# EasyEDA Pro project Attiny85 Tach board.eprj

# Schematic With Schmitt New opto type
Board Name: Board2_2; Create Date: 2026-06-11; Page Name: P1; Project Name: Attiny85 Tach board; Schematic Name: With Schmitt New opto type; Update Date: 2026-06-12; Company: EasyEDA.com; Page Size: A4; Version: V1.0
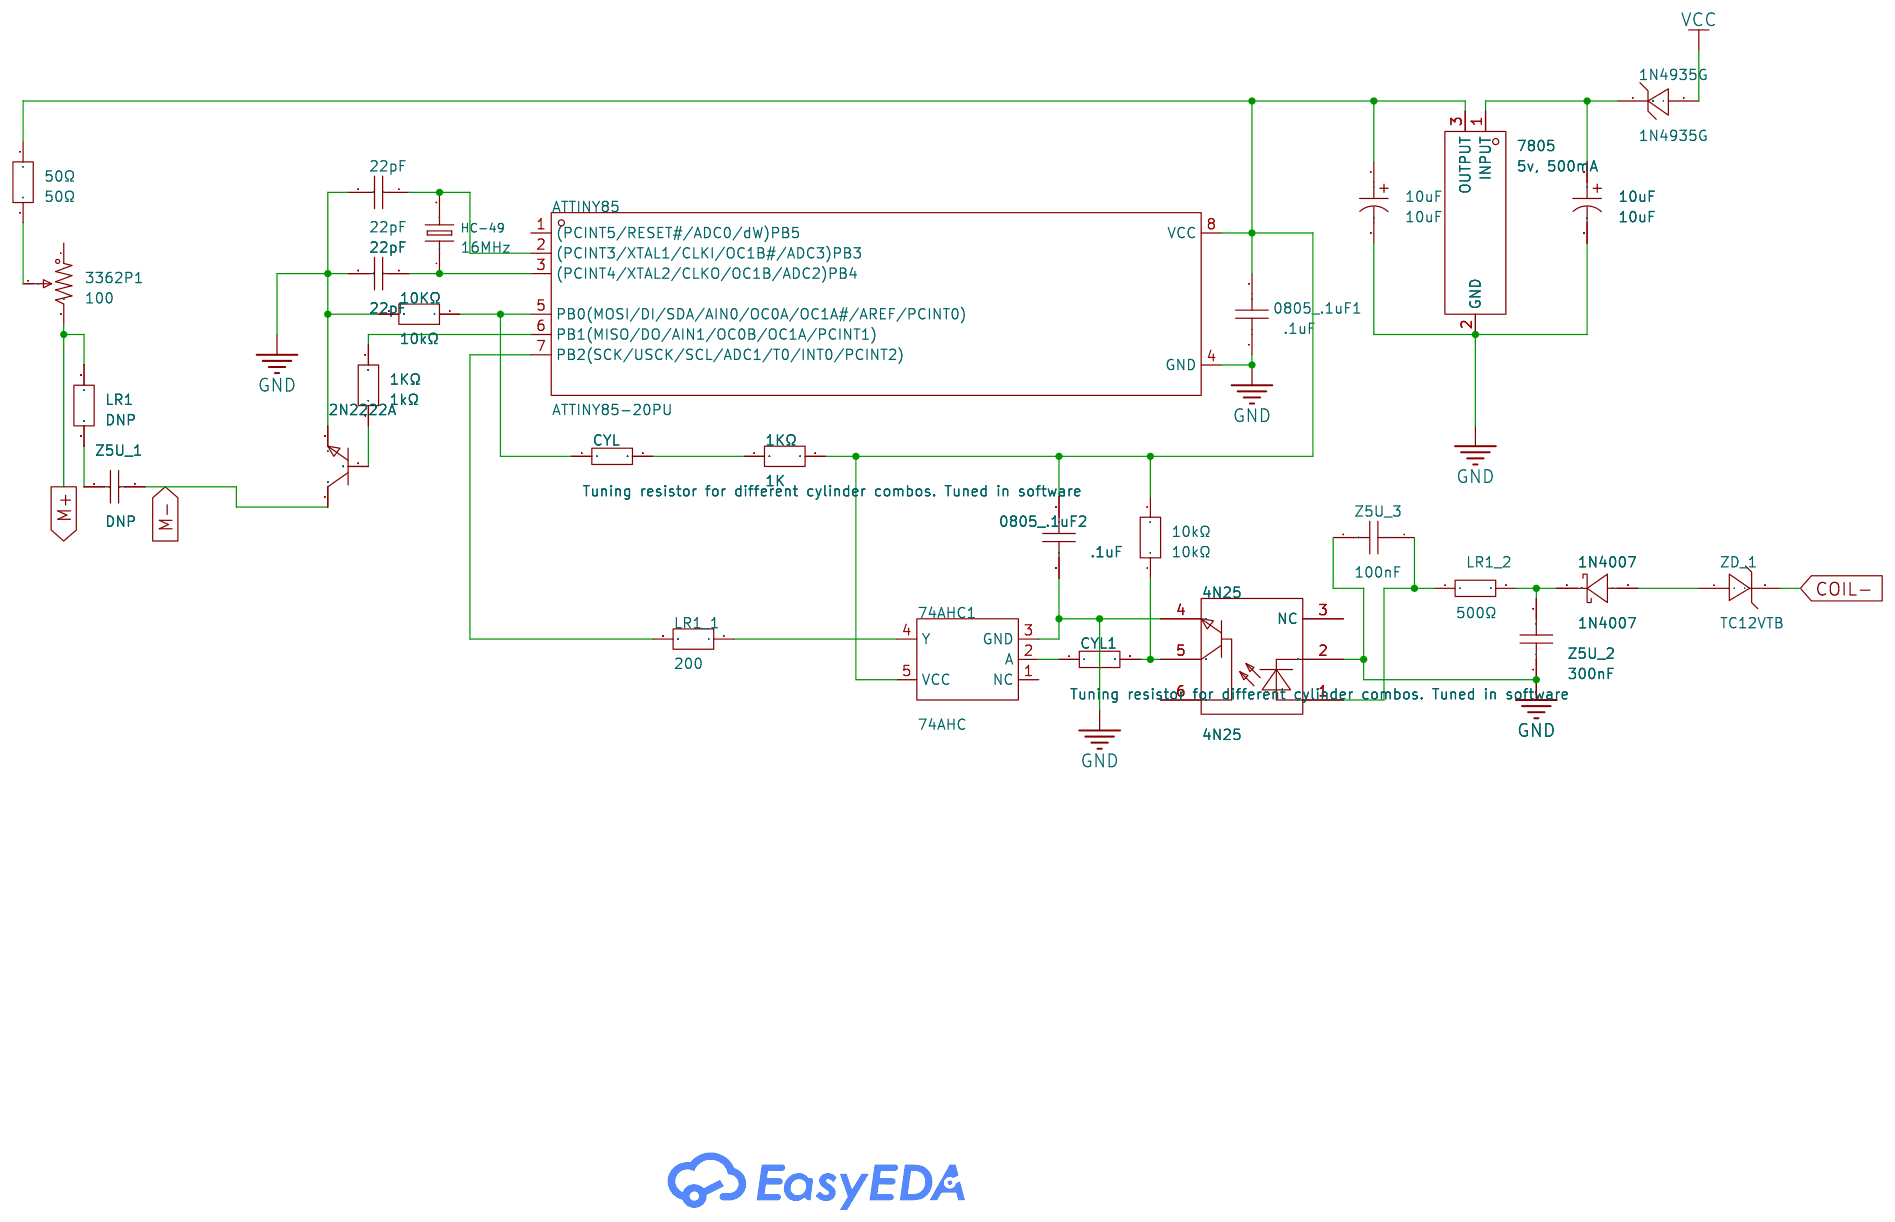
[diagram p0: schematic sheet]

## Parts
1KΩ  1kΩ  [RES-TH_BD2.5-L6.5-P10.50-D0.6]
1KΩ#2  1K  [RES-TH_BD2.5-L6.5-P10.50-D0.6]
1N4007  1N4007  [DO-41_BD2.4-L4.7-P8.70-D0.8-RD]
1N4935G  1N4935G  [DO-41_BD2.4-L4.7-P8.70-D0.9-RD]
2N2222A  3 Pin transistor  [TO-92-3_L4.8-W3.7-P2.54-R]
4N25  4N25  [DIP-6_L7.1-W6.5-P2.54-LS7.6-BL]
10KΩ  10kΩ  [RES-TH_BD2.5-L6.5-P10.50-D0.6]
10kΩ  10kΩ  [RES-TH_BD2.5-L6.5-P10.50-D0.6]
10uF  10uF  [CAP-TH_BD5.0-P2.00-D0.5-FD]
10uF#2  10uF  [CAP-TH_BD5.0-P2.00-D0.5-FD]
22pF  22pF  [CAP-TH_L5.0-W3.2-P2.50-D0.5]
22pF#2  22pF  [CAP-TH_L5.0-W3.2-P2.50-D0.5]
50Ω  50Ω  [RES-TH_BD2.5-L6.5-P10.50-D0.6]
74AHC1  74AHC  [SOT-23-5_L3.0-W1.5-P0.95-LS2.8-BL]
0805_.1uF1  .1uF  [C0805]
0805_.1uF2  .1uF  [C0805]
3362P1  100  [RES-ADJ-TH_3362P]
7805  5v, 500mA  [TO-220-3_L10.0-W4.5-P2.54-L]
ATTINY85  ATTINY85-20PU  [PDIP-8_L9.3-W6.4-P2.54-LS7.9-BL-1]
CYL  Tuning resistor for different cylinder combos. Tuned in software  [C0805]
CYL1  Tuning resistor for different cylinder combos. Tuned in software  [C0805]
HC-49  16MHz  [HC-49US_L11.5-W4.5-P4.88]
LR1  DNP  [RES-TH_BD2.5-L6.5-P10.50-D0.6]
LR1_1  200  [RES-TH_BD2.5-L6.5-P10.50-D0.6]
LR1_2  500Ω  [RES-TH_BD2.5-L6.5-P10.50-D0.6]
Z5U_1  DNP  [CAP-TH_L5.0-W3.2-P2.50-D0.5]
Z5U_2  300nF  [CAP-TH_L4.5-W3.0-P5.00-D0.5]
Z5U_3  100nF  [CAP-TH_L4.5-W3.0-P5.00-D0.5]
ZD_1  TC12VTB  [DO-35_BD2.0-L4.2-P8.20-D0.5-R-RD]

## Library data of the parts
1KΩ 1KΩ#2 10KΩ 50Ω LR1 LR1_1 = NFR25H0001001JR500: Type:Metal Film Resistor Resistance:1kΩ Tolerance:±5% Tolerance:±5% Power(Watts):500mW Temperature Coefficient:±100ppm/℃ Temperature Coefficient:±100ppm/℃ Operating Temperature:-55℃~+155℃ Operating Temperature:-55℃~+155℃; LCSC Part Name: 金属膜电阻 1kΩ ±5% 500mW; Supplier Part: C1741005; Manufacturer: VISHAY(威世); Supplier Footprint: 插件,D2.5xL6.5mm; JLCPCB Part Class: Extended Part; Datasheet: https://item.szlcsc.com/datasheet/NFR25H0001001JR500/1831786.html; Supplier: LCSC; Type: Metal Film Resistor; Tolerance: ±5%; Power(Watts): 500mW; Temperature Coefficient: ±100ppm/℃; Operating Temperature: -55℃~+155℃
1N4007 = 1N4007_C53664484: Diode Configuration:1 Independent Voltage - Forward(Vf@If):1.1V@1A Voltage - DC Reverse(Vr):1kV Current - Rectified:1A Reverse Leakage Current (Ir):5uA@1000V Non-Repetitive Peak Forward Surge Current:30A Operating Junction Temperature Range:-55℃~+150℃ Ope; LCSC Part Name: 轴向通用整流二极管，低正向压降、高电流能力、高可靠性和高浪涌电流能力; Supplier Part: C53664484; Manufacturer: R+O(宏嘉诚); Supplier Footprint: DO-41; JLCPCB Part Class: Extended Part; Datasheet: https://item.szlcsc.com/datasheet/1N4007/56855908.html; Supplier: LCSC; Diode Configuration: 1 Independent; Voltage - Forward(Vf@If): 1.1V@1A; Voltage - DC Reverse(Vr): 1kV; Current - Rectified: 1A; Reverse Leakage Current (Ir): 5uA@1000V; Non-Repetitive Peak Forward Surge Current: 30A; Operating Junction Temperature Range: -55℃~+150℃
1N4935G = 1N4935G: LCSC Part Name: 耐压:200V 电流:1A 反向恢复时间：150ns; Supplier Part: C898876; Manufacturer: onsemi(安森美); Supplier Footprint: DO-41; JLCPCB Part Class: Extended Part; Datasheet: https://item.szlcsc.com/datasheet/1N4935G/964313.html; Supplier: LCSC; Voltage - Forward(Vf@If): 1.05V@1A; Voltage - DC Reverse(Vr): 200V; Current - Rectified: 1A; Reverse Leakage Current (Ir): 1uA@200V; Reverse Recovery Time (trr): 150ns; Operating Junction Temperature Range: -65℃~+150℃; Non-Repetitive Peak Forward Surge Current: 30A
2N2222A = 2N2222A_C358533: LCSC Part Name: (100-300) TO-92塑封封装NPN半导体三极管 NPN 电流:600mA 电压:40V; Supplier Part: C358533; Manufacturer: BLUE ROCKET(蓝箭); Supplier Footprint: TO-92; JLCPCB Part Class: Extended Part; Datasheet: https://item.szlcsc.com/datasheet/2N2222A/333502.html; Supplier: LCSC; type: NPN; Current - Collector(Ic): 600mA; Collector - Emitter Voltage VCEO: 40V; Pd - Power Dissipation: 625mW; DC Current Gain: 100@150mA,10V; Transition frequency(fT): 300MHz; Current - Collector Cutoff: 10nA; Vce Saturation(VCE(sat)): 300mV@150mA,15mA; Emitter-Base Voltage(Vebo): 6V; Number: 1 NPN
4N25 = 4N25: Forward Voltage:1.3V Output Current:50mA Isolation Voltage(rms):5kV Number of Outputs:1 Rise time:2us Fall time:2us Operating Temperature:-55℃~+100℃ Operating Temperature:-55℃~+100℃; Supplier Part: C3008818; Manufacturer: VISHAY(威世); Supplier Footprint: DIP-6; JLCPCB Part Class: Extended Part; Datasheet: https://atta.szlcsc.com/upload/public/pdf/source/20220512/DCD730118474C0EE1EA694047C839E34.pdf; Supplier: LCSC; Forward Voltage: 1.3V; Output Current: 50mA; Isolation Voltage(rms): 5kV; Number of Outputs: 1; Rise time: 2us; Fall time: 2us; Operating Temperature: -55℃~+100℃
10kΩ = LR1F1K0: Type:Metal Film Resistor Resistance:1kΩ Tolerance:±1% Tolerance:±1% Power(Watts):600mW Temperature Coefficient:±50ppm/℃ Temperature Coefficient:±50ppm/℃ Operating Temperature:- Operating Temperature:-; LCSC Part Name: 金属膜电阻 1kΩ ±1% 600mW; Supplier Part: C1364136; Manufacturer: TE Connectivity(泰科电子); Supplier Footprint: 插件; JLCPCB Part Class: Extended Part; Datasheet: https://item.szlcsc.com/datasheet/LR1F1K0/1454424.html; Supplier: LCSC; Type: Metal Film Resistor; Tolerance: ±1%; Power(Watts): 600mW; Temperature Coefficient: ±50ppm/℃
10uF 10uF#2 = ECA-1EM100: Capacitance: Tolerance:±20% Tolerance:±20% Rated Voltage: Ripple Current:85mA@10kHz Equivalent Series Resistance(ESR):- Lead Spacing: φD: Lifetime @ Temp:2000hrs@85℃ Operating Temperature:-40℃~+85℃ Operating Temperature:-40℃~+85℃; LCSC Part Name: 10uF ±20% 25V; Supplier Part: C1580384; Manufacturer: PANASONIC(松下); Supplier Footprint: 插件; JLCPCB Part Class: Extended Part; Datasheet: https://atta.szlcsc.com/upload/public/pdf/source/20210615/C1580384_709C93ACF7E1C72DB0708202B2806885.pdf; Supplier: LCSC; Tolerance: ±20%; Ripple Current: 85mA@10kHz; Lifetime @ Temp: 2000hrs@85℃; Operating Temperature: -40℃~+85℃
22pF 22pF#2 Z5U_1 = K220K15C0GH53L2: Capacitance:22pF Tolerance:±10% Tolerance:±10% Voltage Rating:100V Temperature Coefficient:C0G Pin Spacing:2.5mm; LCSC Part Name: 22pF ±10% 100V; Supplier Part: C1621360; Manufacturer: VISHAY(威世); Supplier Footprint: 插件,P=2.5mm; JLCPCB Part Class: Extended Part; Datasheet: https://item.szlcsc.com/datasheet/K220K15C0GH53L2/1712206.html; Supplier: LCSC; Tolerance: ±10%; Voltage Rating: 100V; Temperature Coefficient: C0G; Pin Spacing: 2.5mm
74AHC1 = 74AHC1G14GV: LCSC Part Name: 单施密特触发器反相器门; Supplier Part: C19829586; Manufacturer: TECH PUBLIC(台舟); Supplier Footprint: SOT-23-5; JLCPCB Part Class: Extended Part; Datasheet: https://item.szlcsc.com/datasheet/74AHC1G14GV/21156881.html; Supplier: LCSC; Number of Channels: 1; Voltage - Supply: 2V~5.5V; Quiescent Current: 40uA; Current - Output Low(IOL): 8mA; Current - Output High(IOH): 8mA; Input Logic Level - High: 2.15V~3.85V；1.75V~3.15V；1.2V~2.2V; Input Logic Level - Low: 900mV~1.9V；1.35V~2.75V；1.65V~3.35V; Propagation Delay: 16.3ns@3.3V,15pF; Operating Temperature: -40℃~+125℃; Input Number: 1
0805_.1uF1 0805_.1uF2 = CGA0805X6S107M4R0MT: Capacitance:100uF Tolerance:±20% Tolerance:±20% Voltage Rating:4V Temperature Coefficient:X6S; LCSC Part Name: 100uF ±20% 4V; Supplier Part: C42371696; Manufacturer: HRE(芯声); Supplier Footprint: 0805; Datasheet: https://item.szlcsc.com/datasheet/CGA0805X6S107M4R0MT/44253246.html; Supplier: LCSC; Tolerance: ±20%; Voltage Rating: 4V; Temperature Coefficient: X6S
3362P1 = 3362P-1-103_C118956: LCSC Part Name: 10kΩ ±10%; Supplier Part: C118956; Manufacturer: BOCHEN(博晨); Manufacturer Part: 3362P-1-103; Supplier Footprint: 插件; JLCPCB Part Class: Extended Part; Datasheet: https://atta.szlcsc.com/upload/public/pdf/source/20171114/C118956_15106326650691117445.pdf; Supplier: LCSC; Tolerance: ±10%
7805 = L7805CV(UMW): LCSC Part Name: 输入35V 输出5V 1.2A; Supplier Part: C347289; Manufacturer: UMW(友台半导体); Supplier Footprint: TO-220; JLCPCB Part Class: Extended Part; Datasheet: https://item.szlcsc.com/datasheet/L7805CV(UMW)/323949.html; Supplier: LCSC; Output Type: Fixed; Voltage - Supply: 20V; Output Voltage: 5V; Output Current: 1.2A; standby current: 6mA; Features: Short Circuit Protection；Over Temperature Protection; Operating Temperature: -40℃~+105℃@(Ta); Output Configuration: Positive; Number of Outputs: 1
ATTINY85 = ATTINY85-20PU: Supplier Part: C965497; Manufacturer: MICROCHIP(美国微芯); Supplier Footprint: PDIP-8; JLCPCB Part Class: Extended Part; Datasheet: https://item.szlcsc.com/datasheet/ATTINY85-20PU/1052792.html; Supplier: LCSC; CPU Core: AVR; CPU Maximum Speed: 20MHz; Core Size: 8 Bit; Program Storage Size: 8KB; Program Memory Type: FLASH; RAM Size: 512Byte; EEPROM: 512Byte; Number of I/O: 6; ADC (Bit): 10bit; Oscillator Type: Built-in; Voltage - Supply: 2.7V~5.5V; Operating Temperature: -40℃~+85℃
CYL CYL1 = Res_0603: Supplier Footprint: 0603
HC-49 = HC-49/U-S20000000ABJB: LCSC Part Name: 20MHz ±30ppm 18pF; Supplier Part: C326539; Manufacturer: CITIZEN; Supplier Footprint: HC-49S; JLCPCB Part Class: Extended Part; Datasheet: https://atta.szlcsc.com/upload/public/pdf/source/20181213/C326539_623418ED4432342CEDE2EF69401BC513.pdf; Supplier: LCSC; Normal temperature Frequency Tolerance: ±30ppm; Frequency Stability(Full temperature range): ±50ppm; Equivalent Series Resistance (ESR): 50Ω
LR1_2 = RN1WS390ΩFT/BA1: Type:Metal Film Resistor Resistance:390Ω Tolerance:±1% Tolerance:±1% Voltage-Supply(Max):350V Power(Watts):1W Temperature Coefficient:±50ppm/℃ Temperature Coefficient:±50ppm/℃; LCSC Part Name: 390Ω ±1% 1W 金属膜电阻; Supplier Part: C385382; Manufacturer: Tyohm(幸亚电阻); Manufacturer Part: NFR25H0001001JR500; Supplier Footprint: 插件,D3.3xL9.2mm; JLCPCB Part Class: Extended Part; Datasheet: https://item.szlcsc.com/datasheet/RN1WS390%25CE%25A9FT%252FBA1/359229.html; Supplier: LCSC; Type: Metal Film Resistor; Tolerance: ±1%; Voltage-Supply(Max): 350V; Power(Watts): 1W; Temperature Coefficient: ±50ppm/℃
Z5U_2 = FG24X7R1H224KNT00: Capacitance: Tolerance:±10% Tolerance:±10% Voltage Rated: Temperature Coefficient:; LCSC Part Name: 220nF ±10% 50V; Supplier Part: C3690393; Manufacturer: TDK; JLCPCB Part Class: Extended Part; Supplier: LCSC; Tolerance: ±10%
Z5U_3 = FG24X7R2A104KNT00: Capacitance:0.1uF Tolerance:±10% Tolerance:±10% Voltage Rated: Temperature Coefficient:; LCSC Part Name: 100nF ±10% 100V; Supplier Part: C1623763; Manufacturer: TDK; Supplier Footprint: 插件; JLCPCB Part Class: Extended Part; Datasheet: https://atta.szlcsc.com/upload/public/pdf/source/20210603/7C07ADBE9CEF1AEE8735D13453ED6990.pdf; Supplier: LCSC; Tolerance: ±10%
ZD_1 = TC12VTB: Diode Configuration:1 Independent Zener Voltage(Nom):12V Reverse Leakage Current (Ir):200nA@9V Zener Voltage(Range):11.4V~12.6V Zener Voltage(Range):11.4V~12.6V Pd - Power Dissipation:500mW Impedance(Zzt):30Ω Impedance(Zzk):- Operating Junction Temperatur; LCSC Part Name: 独立式 耐压:12V 电流:200nA@9V; Supplier Part: C261230; Manufacturer: TC(德昌); Supplier Footprint: DO-35; JLCPCB Part Class: Extended Part; Datasheet: https://item.szlcsc.com/datasheet/TC12VTB/252943.html; Supplier: LCSC; Diode Configuration: 1 Independent; Zener Voltage(Nom): 12V; Reverse Leakage Current (Ir): 200nA@9V; Zener Voltage(Range): 11.4V~12.6V; Pd - Power Dissipation: 500mW; Impedance(Zzt): 30Ω; Tolerance: ±5%

## Nets
GND: 2N2222A.3(E) 4N25.2 4N25.4 10KΩ.2 10uF.2 10uF#2.2 22pF.2 22pF#2.2 74AHC1.3(GND) 0805_.1uF1.1 0805_.1uF2.1 7805.2(GND) ATTINY85.4(GND) Z5U_2.1 Z5U_3.2
VCC: 1N4935G.2(A)
COIL-: ZD_1.2(K)
M+: 3362P1.3 LR1.1
M-: 2N2222A.1(C) Z5U_1.1
$1N8148: 4N25.1 LR1_2.1 Z5U_3.1
$1N8161: 1N4007.1(C) LR1_2.2 Z5U_2.2
$1N8165: 1N4007.2(A) ZD_1.1(A)
$1N10209: 10KΩ.1 ATTINY85.5(PB0(MOSI/DI/SDA/AIN0/OC0A/OC1A#/AREF/PCINT0)) CYL.1
$1N10211: 50Ω.2 3362P1.2
$1N10216: ATTINY85.7(PB2(SCK/USCK/SCL/ADC1/T0/INT0/PCINT2)) LR1_1.2
$1N10218: LR1.2 Z5U_1.2
$1N10220: 74AHC1.4(Y) LR1_1.1
$1N10223: 1N4935G.1(C) 10uF.1 7805.1(INPUT)
$1N10386: 74AHC1.2(A) CYL1.1
$1N10391: 4N25.5 10kΩ.1 CYL1.2
Net-(1KΩ#2-1): 1KΩ#2.1 10kΩ.2 10uF#2.1 50Ω.1 74AHC1.5(VCC) 0805_.1uF1.2 0805_.1uF2.2 7805.3(OUTPUT) ATTINY85.8(VCC)
Net-(1KΩ#2-2): 1KΩ#2.2 CYL.2
Net-(1KΩ-1): 1KΩ.1 2N2222A.2(B)
Net-(1KΩ-2): 1KΩ.2 ATTINY85.6(PB1(MISO/DO/AIN1/OC0B/OC1A/PCINT1))
Net-(22pF#2-1): 22pF#2.1 ATTINY85.2((PCINT3/XTAL1/CLKI/OC1B#/ADC3)PB3) HC-49.2
Net-(22pF-1): 22pF.1 ATTINY85.3((PCINT4/XTAL2/CLKO/OC1B/ADC2)PB4) HC-49.1

Not connected (* = marked no-connect by the designer): 4N25 3(NC) 6; 74AHC1 1(NC); 3362P1 1; ATTINY85 1((PCINT5/RESET#/ADC0/dW)PB5)

# Board Board Type A
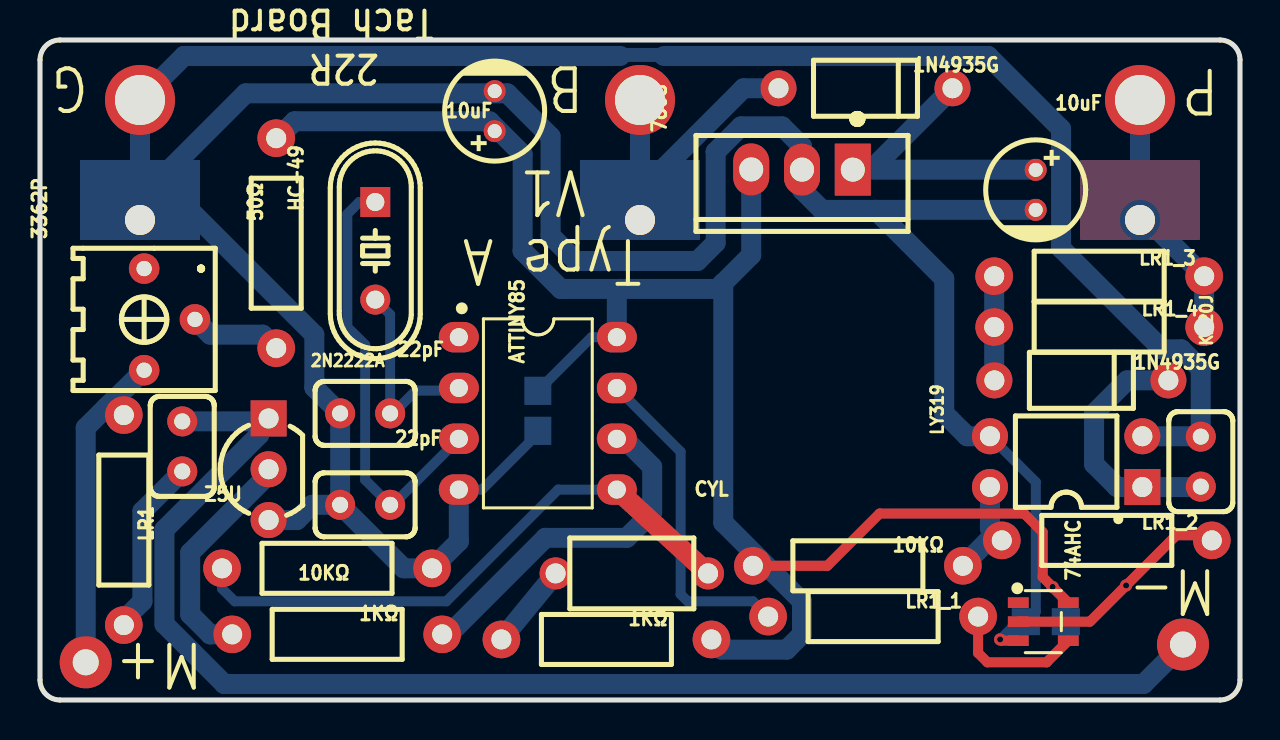
[diagram p1: board, top side]
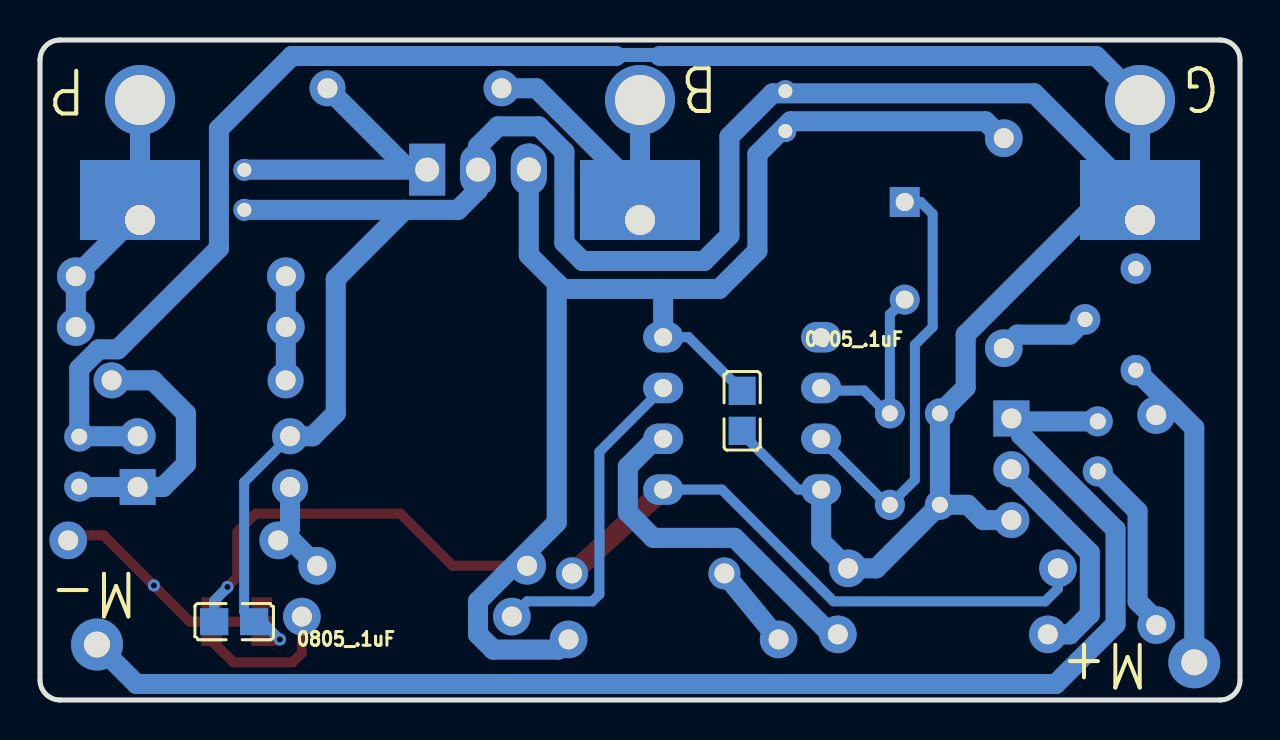
[diagram p2: board, bottom side, seen from below]

Outline 60 x 33 mm; copper layers: Top Layer, Bottom Layer. Coordinates in mm from the lower left corner of the outline.
Outline path: 0,32 0,1 arc(0.29,0.29) 1,0 59,0 arc(59.71,0.29) 60,1 60,32 arc(59.71,32.71) 59,33 1,33 arc(0.29,32.71) 0,32
Stack: Top Layer 0.035mm / Dielectric1 1.51mm FR4 er 4.5 / Bottom Layer 0.035mm

## Design rules (mm)
template: JLCPCB Capability(Two Layers Board)
spacing copperThickness1oz (default): track to track 0.102, other pairs 0.152 to 0.3
spacing copperThickness2oz: track to track 0.203, other pairs 0.152 to 0.3
track width copperThickness1oz (default): min 0.127, default 0.254, max 2.54
track width copperThickness2oz: min 0.203, default 0.254, max 2.54
differential pair differentialPair (default): width min 0.127, default 0.254, max 2.54; gap min 0.152, default 0.152
via viaSize (default): diameter min 0.5, default 0.61, max 10; hole min 0.3, default 0.305, max 6.3

## Placement (name value [footprint] x y rotation side)
1KΩ  -  [RES-TH_BD2.5-L6.5-P10.50-D0.6]  28.32 3.03 180 top
1KΩ#2  -  [RES-TH_BD2.5-L6.5-P10.50-D0.6]  14.86 3.28 0 top
1N4935G  -  [DO-41_BD2.4-L4.7-P8.70-D0.9-RD]  41.28 30.59 180 top
1N4935G#2  -  [DO-41_BD2.4-L4.7-P8.70-D0.9-RD]  52.07 15.98 180 top
2N2222A  3 Pin transistor  [TO-92-3_L4.8-W3.7-P2.54-R]  11.43 11.54 90 top
10KΩ  -  [RES-TH_BD2.5-L6.5-P10.50-D0.6]  40.89 6.71 0 top
10KΩ#2  -  [RES-TH_BD2.5-L6.5-P10.50-D0.6]  14.35 6.58 0 top
10uF  -  [CAP-TH_BD5.0-P2.00-D0.5-FD]  22.73 29.44 90 top
10uF#2  -  [CAP-TH_BD5.0-P2.00-D0.5-FD]  49.78 25.51 270 top
22pF  -  [CAP-TH_L5.0-W3.2-P2.50-D0.5]  16.26 9.76 180 top
22pF#2  -  [CAP-TH_L5.0-W3.2-P2.50-D0.5]  16.26 14.33 180 top
50Ω  50Ω  [RES-TH_BD2.5-L6.5-P10.50-D0.6]  11.81 22.84 270 top
74AHC  74AHC  [SOT-23-5_L3.0-W1.5-P0.95-LS2.8-BL]  50.16 3.92 270 top
0805_.1uF  -  [C0805]  24.89 14.46 90 bottom
0805_.1uF#2  -  [C0805]  50.29 3.92 0 bottom
3362P  100  [RES-ADJ-TH_3362P]  6.48 19.03 270 top
7805  5v, 500mA  [TO-220-3_L10.0-W4.5-P2.54-L]  38.1 26.52 180 top
ATTINY85  ATTINY85-20PU  [PDIP-8_L9.3-W6.4-P2.54-LS7.9-BL-1]  24.89 14.33 270 top
CYL  DS04-254-2L-01BK  [SW-TH_DS04-254-2L-01BK]  29.59 6.33 90 top
HC-49  16MHz  [HC-49US_L11.5-W4.5-P4.88]  16.76 22.46 270 top
K220J  DNP  [CAP-TH_L5.0-W3.2-P2.50-D0.5]  58.04 11.92 270 top
LR1  DNP  [RES-TH_BD2.5-L6.5-P10.50-D0.6]  4.19 9 270 top
LR1_1  200  [RES-TH_BD2.5-L6.5-P10.50-D0.6]  41.66 4.17 180 top
LR1_2  10Ω  [RES-TH_BD2.5-L6.5-P10.50-D0.6]  53.34 7.98 180 top
LR1_3  22KΩ  [RES-TH_BD2.5-L6.5-P10.50-D0.6]  52.96 21.19 0 top
LR1_4  33KΩ  [RES-TH_BD2.5-L6.5-P10.50-D0.6]  52.96 18.65 180 top
LY319  Optocoupler  [DIP-4_L6.5-W4.6-P2.54-LS7.6-BL]  51.31 11.92 90 top
NOREF  -  [Pad_e362]  30 24 0 top
NOREF#2  -  [Pad_e34]  57.15 2.77 90 top
NOREF#3  -  [Pad_e360]  55 25 0 top
NOREF#4  -  [Pad_e359]  5 25 0 top
NOREF#5  -  [Pad_e357]  30 25 0 top
NOREF#6  -  [Pad_e368]  55 24 0 top
NOREF#7  -  [Pad_e33]  2.29 1.89 0 top
NOREF#8  -  [Pad_e367]  5 24 0 top
NOREF#9  -  [Pad_e21]  30 30 0 top
NOREF#10  -  [Pad_e22]  55 30 0 top
NOREF#11  -  [Pad_e20]  5 30 0 top
Z5U  DNP  [CAP-TH_L5.0-W3.2-P2.50-D0.5]  7.11 12.68 270 top

## Footprints (pads in the part's own frame, mm; a bottom-side part is the same pattern mirrored in y, then rotated)
C0805
  rect 1.41x1.35 smd: 1(-1,0) 2(1,0)
CAP-TH_BD5.0-P2.00-D0.5-FD
  round 1.1 hole 0.7: 1(-1,0) 2(1,0)
CAP-TH_L5.0-W3.2-P2.50-D0.5
  round 1.5 hole 0.8: 1(-1.25,0) 2(1.25,0)
DIP-4_L6.5-W4.6-P2.54-LS7.6-BL
  rect 1.8x1.8 hole 1: 1(-1.27,-3.81)
  round 1.8 hole 1: 2(1.27,-3.81) 3(1.27,3.81) 4(-1.27,3.81)
DO-41_BD2.4-L4.7-P8.70-D0.9-RD
  round 1.8 hole 1: 1(-4.35,0) 2(4.35,0)
HC-49US_L11.5-W4.5-P4.88
  rect 1.5x1.5 hole 0.9: 1(-2.44,0)
  round 1.5 hole 0.9: 2(2.44,0)
Pad_e20
  round 3.5 hole 2.5: G(0,0)
Pad_e21
  round 3.5 hole 2.5: B(0,0)
Pad_e22
  round 3.5 hole 2.5: P(0,0)
Pad_e33
  round 2.6 hole 1.3: (0,0)
Pad_e34
  round 2.6 hole 1.3: (0,0)
Pad_e357
  rect 6x4 smd far side: 1(0,0)
Pad_e359
  rect 6x4 smd far side: 1(0,0)
Pad_e360
  rect 6x4 smd far side: 1(0,0)
Pad_e362
  round 1.5 hole 1.5: 1(0,0)
Pad_e367
  round 1.5 hole 1.5: 1(0,0)
Pad_e368
  round 1.5 hole 1.5: 1(0,0)
PDIP-8_L9.3-W6.4-P2.54-LS7.9-BL-1
  oval 1.524x2 hole 0.9: 1(-3.81,-3.95) 2(-1.27,-3.95) 3(1.27,-3.95) 4(3.81,-3.95) 5(3.81,3.95) 6(1.27,3.95) 7(-1.27,3.95) 8(-3.81,3.95)
RES-ADJ-TH_3362P
  round 1.524 hole 0.762: 1(-2.54,-1.27) 2(0,1.27) 3(2.54,-1.27)
RES-TH_BD2.5-L6.5-P10.50-D0.6
  round 1.879 hole 1: 1(-5.25,0) 2(5.25,0)
SOT-23-5_L3.0-W1.5-P0.95-LS2.8-BL
  rect 0.532x1.045 smd: 1(-0.95,-1.25) 2(0,-1.25) 3(0.95,-1.25) 4(0.95,1.25) 5(-0.95,1.25)
SW-TH_DS04-254-2L-01BK
  round 1.6 hole 1: 1(0,-3.81) 2(0,3.81)
TO-92-3_L4.8-W3.7-P2.54-R
  rect 1.8x1.8 hole 1: 1(2.54,0)
  round 1.8 hole 1: 2(0,0) 3(-2.54,0)
TO-220-3_L10.0-W4.5-P2.54-L
  rect 1.8x2.6 hole 1.2: 1(-2.54,0.005)
  oval 1.8x2.6 hole 1.2: 2(0,0.005) 3(2.54,-0.005)

## Nets
GND: 2N2222A.3 10KΩ#2.2 10uF.2 10uF#2.2 22pF.2 22pF#2.2 74AHC.3 0805_.1uF.1 0805_.1uF#2.1 7805.2 ATTINY85.4 K220J.1 LY319.2 LY319.3 NOREF#4.1 NOREF#8.1 NOREF#11.G
VCC: 1N4935G.2 NOREF.1 NOREF#5.1 NOREF#9.B
COIL-: LR1_3.2 LR1_4.1 NOREF#3.1 NOREF#6.1 NOREF#10.P
M+: 3362P.3 LR1.1 NOREF#7.
M-: 2N2222A.1 NOREF#2. Z5U.1
$1N1074: 10KΩ#2.1 ATTINY85.5 CYL.1
$1N1092: 22pF#2.1 ATTINY85.2 HC-49.2
$1N1097: 1KΩ#2.2 ATTINY85.6
$1N1099: 1KΩ#2.1 2N2222A.2
$1N1119: 1N4935G.1 10uF#2.1 7805.1
$1N1275: 50Ω.2 3362P.2
$1N3968: 1KΩ.2 CYL.2
$1N6328: 22pF.1 ATTINY85.3 HC-49.1
$1N6878: ATTINY85.7 LR1_1.2
$1N6982: 74AHC.2 LR1_2.1
$1N6988: 10KΩ.2 LR1_2.2 LY319.4
$1N7004: LR1.2 Z5U.2
$1N7078: 74AHC.4 LR1_1.1
$1N7098: 1KΩ.1 10KΩ.1 10uF.1 50Ω.1 74AHC.5 0805_.1uF.2 0805_.1uF#2.2 7805.3 ATTINY85.8
$1N8000: 1N4935G#2.2 LR1_3.1 LR1_4.2
$1N8005: 1N4935G#2.1 K220J.2 LY319.1

Pads without a net: 74AHC 1; 3362P 1; ATTINY85 1

## Via types
v1: diameter 0.61, hole 0.305, Top Layer to Bottom Layer, 3 vias

## Routing (per net, layer and track width the routed paths; a pad name or vN(x,y) marks a point on that pad's centre or on a via; arc(x,y) is an arc through that point)
GND: length 204.5
  Top Layer w0.5: v1(48.01,3.03) 48.07,2.97 74AHC.3
  Bottom Layer w0.5: ATTINY85.4 22.1,10.52 24.97,13.39 ; LY319.3 49.79,10.89 49.79,4.42 0805_.1uF#2.1 48.9,3.92 v1(48.01,3.03)
  Bottom Layer w0.7: 29.01,32.2 29.07,32.25 30.93,32.25 30.99,32.2 31.2,32.2
  Bottom Layer w1: 22pF.2 13.61,9.76 12.84,9 2N2222A.3 ; 22pF.2 15.01,9.76 18.19,6.58 10KΩ#2.2 20.94,7.92 ATTINY85.4 ; 22pF.2 22pF#2.2 13.72,15.62 13.72,18.27 6.98,25 NOREF#4.1 5,25.05 ; 41.77,24.51 39.1,24.51 38.1,25.51 38.1,27.68 37.1,28.68 35.05,28.68 33.78,27.41 33.78,22.86 32.87,21.95 26.8,21.95 25.53,23.22 25.53,28.17 23.37,30.33 10.29,30.33 5,25.05 ; 41.77,24.51 45.21,21.06 45.21,14.33 46.35,13.19 47.24,13.19 ; 41.77,24.51 10uF#2.2 ; 5,25.05 NOREF#11.G 7.2,32.2 29.01,32.2 ; 47.5,13.44 47.37,13.31 ; LY319.2 58.02,13.19 K220J.1 58.04,16.56 57.06,17.53 56.11,17.53 51.05,22.59 51.05,28.56 47.41,32.2 31.2,32.2
VCC: length 14.1
  Bottom Layer w1: 29.99,25.01 29.97,25 ; NOREF#9.B 30,25.41 ; 30,25.41 NOREF#5.1 ; 30,25.41 35.18,30.59 1N4935G.2
COIL-: length 12.9
  Bottom Layer w1: LR1_3.2 LR1_4.1 ; NOREF#10.P NOREF#6.1 55.4,24 58.17,21.23
M+: length 16.2
  Bottom Layer w1: 2.03,1.63 2.29,1.89 2.29,13.61 3.3,14.63 arc(4.26,15.55) 3362P.3
M-: length 69.5
  Bottom Layer w1: Z5U.1 10.96,13.93 ; 10.96,13.93 11.28,13.93 11.43,14.08 ; 10.96,13.93 10.96,13.26 6.22,8.53 6.22,3.79 9.21,0.8 55.18,0.8 57.15,2.77
$1N1074: length 29.5
  Top Layer w1: CYL.1 ATTINY85.5
  Bottom Layer w0.5: 10KΩ#2.1 9.1,5.57 9.74,4.93 20.32,4.93 25.91,10.52 ATTINY85.5
$1N1092: length 10
  Bottom Layer w0.5: HC-49.2 17.51,19.28 22pF#2.1 17.65,14.33 18.8,15.47 20.81,15.47 ATTINY85.2
$1N1097: length 17.3
  Bottom Layer w1: 20.45,3.28 25.27,8.11 29.34,8.11 30.61,9.38 30.61,11.66 29.21,13.06 ATTINY85.6
$1N1099: length 11.4
  Bottom Layer w1: 1KΩ#2.1 8.51,3.28 7.51,4.28 7.51,7.36 11.43,11.28 2N2222A.2
$1N1119: length 14.7
  Bottom Layer w1: 7805.1 49.77,26.52 10uF#2.1 ; 1N4935G.1 41.69,26.65
$1N1275: length 4.7
  Bottom Layer w1: 3362P.2 8.51,18.27 11.13,18.27 50Ω.2
$1N3968: length 4.3
  Bottom Layer w1: CYL.2 1KΩ.2
$1N6328: length 22.4
  Bottom Layer w0.5: HC-49.1 15.96,24.9 15.37,24.3 15.37,18.65 16.26,17.76 16.26,11.01 22pF.1 ; 22pF.1 17.64,9.76 ATTINY85.3 ; 22pF.1 17.51,9.25
$1N6878: length 16.5
  Bottom Layer w0.5: LR1_1.2 35.64,4.93 32.38,4.93 32.03,5.29 32.03,12.41 ATTINY85.7
$1N6982: length 11.5
  Top Layer w0.5: 74AHC.2 52.49,3.92 v1(54.3,5.73) 56.81,8.23 58.59,8.23
$1N6988: length 5.4
  Bottom Layer w1: LY319.4 47.5,8.57 LR1_2.2 47.41,7.98 10KΩ.2
$1N7004: length 9.1
  Bottom Layer w1: 3.89,3.7 5.12,4.93 5.12,9.44 Z5U.2
$1N7078: length 7
  Top Layer w0.5: LR1_1.1 46.91,2.35 47.37,1.89 50.33,1.89 74AHC.4
$1N7098: length 88.4
  Top Layer w0.5: 36.41,6.71 39.37,6.71 41.98,9.32 49.2,9.32 50.13,8.4 50.13,6.15 v1(50.63,5.65) 74AHC.5
  Bottom Layer w0.5: ATTINY85.8 27.57,18.14 0805_.1uF.2 ; 50.67,5.57 51.29,4.95 0805_.1uF#2.2
  Bottom Layer w1: 28.99,20.55 26.03,20.55 24.13,22.46 24.13,27.28 22.48,28.94 12.73,28.94 11.81,28.02 ; 28.99,20.55 28.84,20.41 ATTINY85.8 ; 28.99,20.55 33.87,20.55 34.16,20.85 ; 1KΩ.1 34.08,2.52 37.34,2.52 38.1,3.28 38.1,4.93 34.16,8.87 34.16,20.85 ; 34.16,20.85 35.56,22.25 7805.3
$1N8000: length 5.3
  Bottom Layer w1: LR1_3.1 LR1_4.2 47.71,16.12 47.85,15.98
$1N8005: length 12.8
  Bottom Layer w1: 1N4935G#2.1 54.36,15.98 52.71,14.33 52.71,11.79 53.85,10.65 LY319.1 58.02,10.65 K220J.2

## Copper pours and planes (outline as drawn; the poured copper is in the pictures)
(no net) on Top Layer: 52,27 58,27 58,23 52,23

Small or netless copper shapes (teardrops, artwork), in the pictures only: 1 on Top Layer

## Text on the board
Bottom Silkscreen Layer: M+ | P | G | B | M-
Top Silkscreen Layer: 22R / Tach Board | G | M+ | B | M- | P | Type A / V1

# Board Board Type B
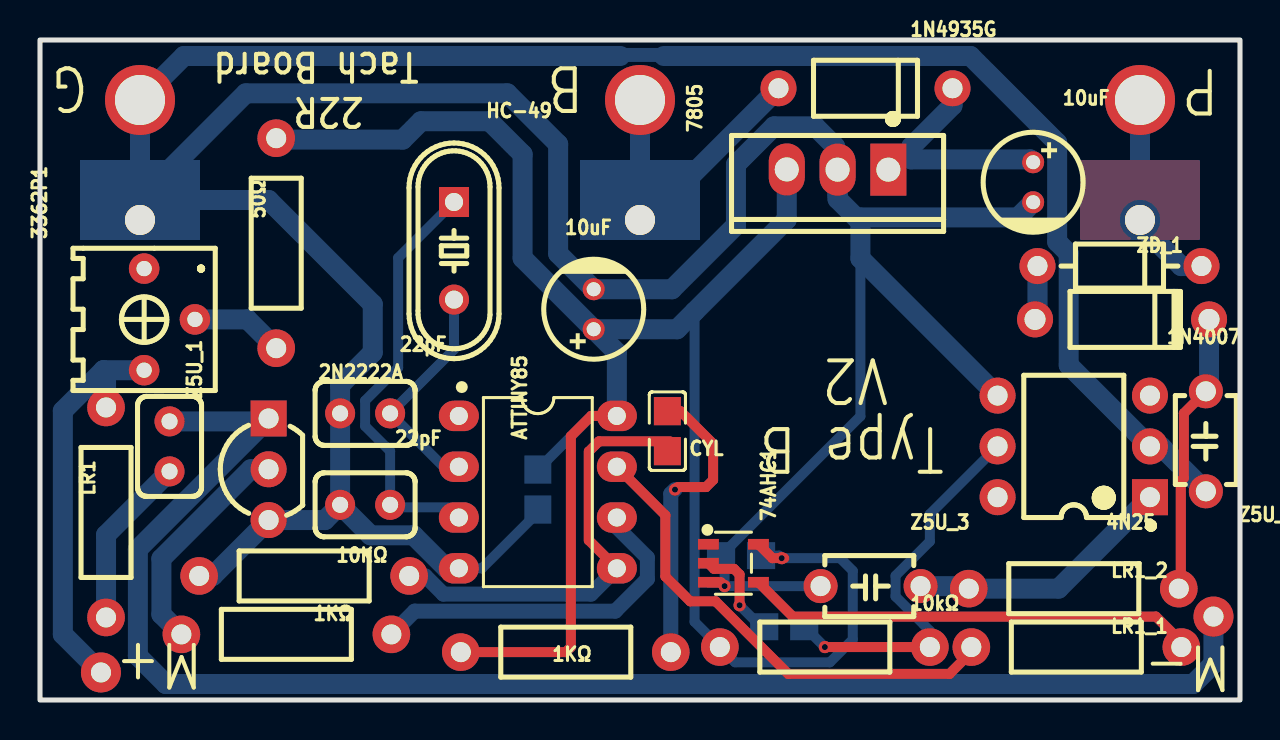
[diagram p3: board, top side]
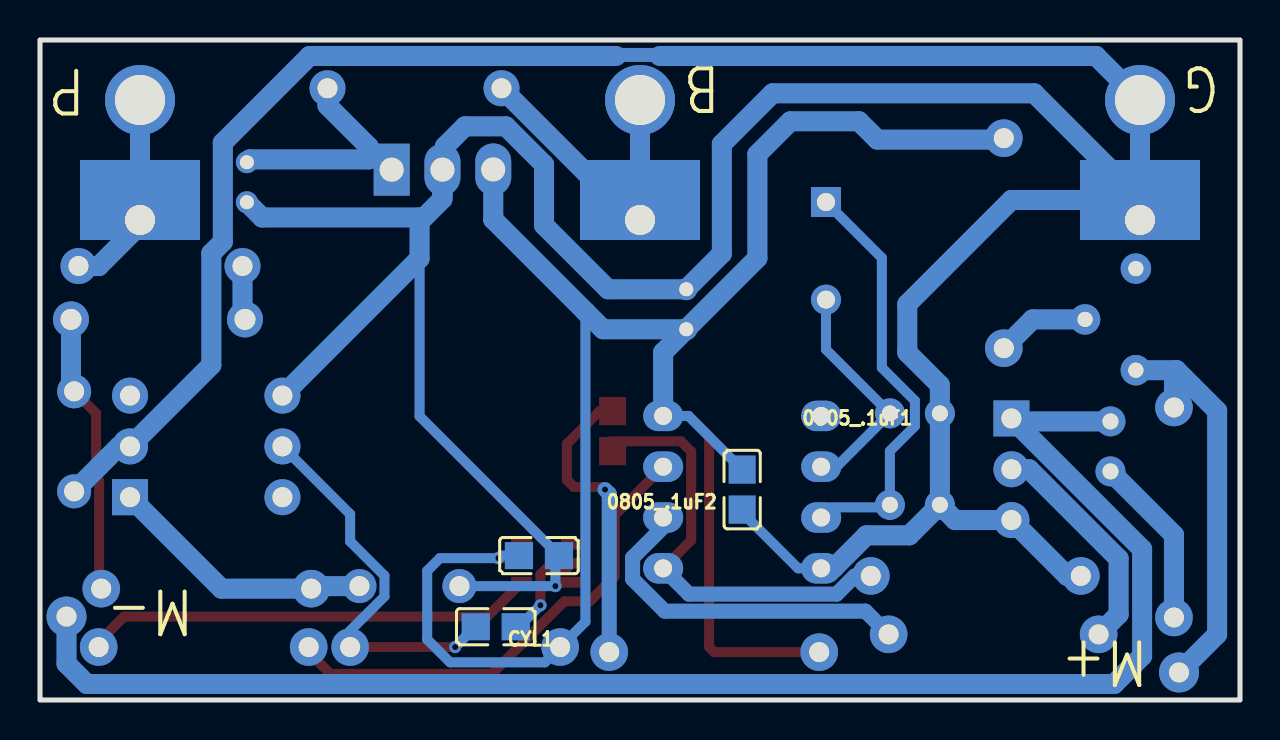
[diagram p4: board, bottom side, seen from below]

Outline 60 x 33 mm; copper layers: Top Layer, Bottom Layer. Coordinates in mm from the lower left corner of the outline.
Outline path: rectangle 0,33 60,0
Stack: Top Layer 0.035mm / Dielectric1 1.51mm FR4 er 4.5 / Bottom Layer 0.035mm

## Design rules (mm)
template: JLCPCB Capability(Two Layers Board)
spacing copperThickness1oz (default): track to track 0.102, other pairs 0.152 to 0.3
spacing copperThickness2oz: track to track 0.203, other pairs 0.152 to 0.3
track width copperThickness1oz (default): min 0.127, default 0.254, max 2.54
track width copperThickness2oz: min 0.203, default 0.254, max 2.54
differential pair differentialPair (default): width min 0.127, default 0.254, max 2.54; gap min 0.152, default 0.152
via viaSize (default): diameter min 0.5, default 0.61, max 10; hole min 0.3, default 0.305, max 6.3

## Placement (name value [footprint] x y rotation side)
1KΩ  1kΩ  [RES-TH_BD2.5-L6.5-P10.50-D0.6]  26.29 2.39 0 top
1KΩ#2  1K  [RES-TH_BD2.5-L6.5-P10.50-D0.6]  12.32 3.28 0 top
1N4007  1N4007  [DO-41_BD2.4-L4.7-P8.70-D0.8-RD]  54.1 19.03 180 top
1N4935G  1N4935G  [DO-41_BD2.4-L4.7-P8.70-D0.9-RD]  41.28 30.59 180 top
2N2222A  3 Pin transistor  [TO-92-3_L4.8-W3.7-P2.54-R]  11.43 11.54 90 top
4N25  4N25  [DIP-6_L7.1-W6.5-P2.54-LS7.6-BL]  51.69 12.68 90 top
10KΩ  10kΩ  [RES-TH_BD2.5-L6.5-P10.50-D0.6]  13.21 6.2 180 top
10kΩ  10kΩ  [RES-TH_BD2.5-L6.5-P10.50-D0.6]  39.24 2.65 180 top
10uF  10uF  [CAP-TH_BD5.0-P2.00-D0.5-FD]  27.69 19.54 90 top
10uF#2  10uF  [CAP-TH_BD5.0-P2.00-D0.5-FD]  49.66 25.89 270 top
22pF  22pF  [CAP-TH_L5.0-W3.2-P2.50-D0.5]  16.26 9.76 180 top
22pF#2  22pF  [CAP-TH_L5.0-W3.2-P2.50-D0.5]  16.26 14.33 180 top
50Ω  50Ω  [RES-TH_BD2.5-L6.5-P10.50-D0.6]  11.81 22.84 270 top
74AHC1  74AHC  [SOT-23-5_L3.0-W1.5-P0.95-LS2.8-BL]  34.67 6.84 270 top
0805_.1uF1  .1uF  [C0805]  24.89 10.52 90 bottom
0805_.1uF2  .1uF  [C0805]  35.05 7.22 0 bottom
3362P1  100  [RES-ADJ-TH_3362P]  6.48 19.03 270 top
7805  5v, 500mA  [TO-220-3_L10.0-W4.5-P2.54-L]  39.88 26.52 180 top
ATTINY85  ATTINY85-20PU  [PDIP-8_L9.3-W6.4-P2.54-LS7.9-BL-1]  24.89 10.39 270 top
CYL  Tuning resistor for different cylinder combos. Tuned in software  [C0805]  31.37 13.44 90 top
CYL1  Tuning resistor for different cylinder combos. Tuned in software  [C0805]  37.21 3.66 0 bottom
HC-49  16MHz  [HC-49US_L11.5-W4.5-P4.88]  20.7 22.46 270 top
LR1  DNP  [RES-TH_BD2.5-L6.5-P10.50-D0.6]  3.3 9.38 270 top
LR1_1  200  [RES-TH_BD2.5-L6.5-P10.50-D0.6]  51.82 2.65 180 top
LR1_2  500Ω  [RES-TH_BD2.5-L6.5-P10.50-D0.6]  51.69 5.57 0 top
NOREF  -  [Pad_e359]  5 25 0 top
NOREF#2  -  [Pad_e368]  55 24 0 top
NOREF#3  -  [Pad_e20]  5 30 0 top
NOREF#4  -  [Pad_e360]  55 25 0 top
NOREF#5  -  [Pad_e21]  30 30 0 top
NOREF#6  -  [Pad_e367]  5 24 0 top
NOREF#7  -  [Pad_e357]  30 25 0 top
NOREF#8  -  [Pad_e22]  55 30 0 top
NOREF#9  -  [Pad_e33]  3.05 1.38 0 top
NOREF#10  -  [Pad_e34]  58.67 4.17 90 top
NOREF#11  -  [Pad_e362]  30 24 0 top
Z5U_1  DNP  [CAP-TH_L5.0-W3.2-P2.50-D0.5]  6.48 12.68 270 top
Z5U_2  300nF  [CAP-TH_L4.5-W3.0-P5.00-D0.5]  58.29 12.93 90 top
Z5U_3  100nF  [CAP-TH_L4.5-W3.0-P5.00-D0.5]  41.53 5.69 180 top
ZD_1  TC12VTB  [DO-35_BD2.0-L4.2-P8.20-D0.5-R-RD]  53.97 21.7 180 top

## Footprints (pads in the part's own frame, mm; a bottom-side part is the same pattern mirrored in y, then rotated)
C0805
  rect 1.41x1.35 smd: 1(-1,0) 2(1,0)
CAP-TH_BD5.0-P2.00-D0.5-FD
  round 1.1 hole 0.7: 1(-1,0) 2(1,0)
CAP-TH_L4.5-W3.0-P5.00-D0.5
  round 1.7 hole 1: 1(-2.5,0) 2(2.5,0)
CAP-TH_L5.0-W3.2-P2.50-D0.5
  round 1.5 hole 0.8: 1(-1.25,0) 2(1.25,0)
DIP-6_L7.1-W6.5-P2.54-LS7.6-BL
  rect 1.8x1.8 hole 1: 1(-2.54,-3.81)
  round 1.8 hole 1: 2(0,-3.81) 3(2.54,-3.81) 4(2.54,3.81) 5(0,3.81) 6(-2.54,3.81)
DO-35_BD2.0-L4.2-P8.20-D0.5-R-RD
  round 1.8 hole 1: 1(4.1,0) 2(-4.1,0)
DO-41_BD2.4-L4.7-P8.70-D0.8-RD
  round 1.8 hole 1.05: 1(-4.35,0) 2(4.35,0)
DO-41_BD2.4-L4.7-P8.70-D0.9-RD
  round 1.8 hole 1: 1(-4.35,0) 2(4.35,0)
HC-49US_L11.5-W4.5-P4.88
  rect 1.5x1.5 hole 0.9: 1(-2.44,0)
  round 1.5 hole 0.9: 2(2.44,0)
Pad_e20
  round 3.5 hole 2.5: G(0,0)
Pad_e21
  round 3.5 hole 2.5: B(0,0)
Pad_e22
  round 3.5 hole 2.5: P(0,0)
Pad_e33
  round 2 hole 1: (0,0)
Pad_e34
  round 2 hole 1: (0,0)
Pad_e357
  rect 6x4 smd far side: 1(0,0)
Pad_e359
  rect 6x4 smd far side: 1(0,0)
Pad_e360
  rect 6x4 smd far side: 1(0,0)
Pad_e362
  round 1.5 hole 1.5: 1(0,0)
Pad_e367
  round 1.5 hole 1.5: 1(0,0)
Pad_e368
  round 1.5 hole 1.5: 1(0,0)
PDIP-8_L9.3-W6.4-P2.54-LS7.9-BL-1
  oval 1.524x2 hole 0.9: 1(-3.81,-3.95) 2(-1.27,-3.95) 3(1.27,-3.95) 4(3.81,-3.95) 5(3.81,3.95) 6(1.27,3.95) 7(-1.27,3.95) 8(-3.81,3.95)
RES-ADJ-TH_3362P
  round 1.524 hole 0.762: 1(-2.54,-1.27) 2(0,1.27) 3(2.54,-1.27)
RES-TH_BD2.5-L6.5-P10.50-D0.6
  round 1.879 hole 1: 1(-5.25,0) 2(5.25,0)
SOT-23-5_L3.0-W1.5-P0.95-LS2.8-BL
  rect 0.532x1.045 smd: 1(-0.95,-1.25) 2(0,-1.25) 3(0.95,-1.25) 4(0.95,1.25) 5(-0.95,1.25)
TO-92-3_L4.8-W3.7-P2.54-R
  rect 1.8x1.8 hole 1: 1(2.54,0)
  round 1.8 hole 1: 2(0,0) 3(-2.54,0)
TO-220-3_L10.0-W4.5-P2.54-L
  rect 1.8x2.6 hole 1.2: 1(-2.54,0.005)
  oval 1.8x2.6 hole 1.2: 2(0,0.005) 3(2.54,-0.005)

## Nets
GND: 2N2222A.3 4N25.2 4N25.4 10KΩ.2 10uF.2 10uF#2.2 22pF.2 22pF#2.2 74AHC1.3 0805_.1uF1.1 0805_.1uF2.1 7805.2 ATTINY85.4 NOREF.1 NOREF#3.G NOREF#6.1 Z5U_2.1 Z5U_3.2
VCC: 1N4935G.2 NOREF#5.B NOREF#7.1 NOREF#11.1
COIL-: NOREF#2.1 NOREF#4.1 NOREF#8.P ZD_1.2
M+: 3362P1.3 LR1.1 NOREF#9.
M-: 2N2222A.1 NOREF#10. Z5U_1.1
$1N8148: 4N25.1 LR1_2.1 Z5U_3.1
$1N8161: 1N4007.1 LR1_2.2 Z5U_2.2
$1N8165: 1N4007.2 ZD_1.1
$1N10205: 1KΩ#2.2 ATTINY85.6
$1N10206: 1KΩ#2.1 2N2222A.2
$1N10209: 10KΩ.1 ATTINY85.5 CYL.1
$1N10210: 22pF#2.1 ATTINY85.2 HC-49.2
$1N10211: 50Ω.2 3362P1.2
$1N10213: 1KΩ.2 CYL.2
$1N10215: 22pF.1 ATTINY85.3 HC-49.1
$1N10216: ATTINY85.7 LR1_1.2
$1N10218: LR1.2 Z5U_1.2
$1N10220: 74AHC1.4 LR1_1.1
$1N10221: 1KΩ.1 10kΩ.2 10uF.1 50Ω.1 74AHC1.5 0805_.1uF1.2 0805_.1uF2.2 7805.3 ATTINY85.8
$1N10223: 1N4935G.1 10uF#2.1 7805.1
$1N10386: 74AHC1.2 CYL1.1
$1N10391: 4N25.5 10kΩ.1 CYL1.2

Pads without a net: 4N25 3 6; 74AHC1 1; 3362P1 1; ATTINY85 1

## Via types
v1: diameter 0.61, hole 0.305, Top Layer to Bottom Layer, 5 vias

## Routing (per net, layer and track width the routed paths; a pad name or vN(x,y) marks a point on that pad's centre or on a via; arc(x,y) is an arc through that point)
GND: length 221
  Top Layer w0.5: v1(34.23,5.69) 34.04,5.89 74AHC1.3
  Bottom Layer w0.5: 24.97,9.46 22.1,6.58 ATTINY85.4 ; Z5U_3.2 v1(34.23,5.69) 34.23,7.04 0805_.1uF2.1 41.02,14.19 41.02,22.08
  Bottom Layer w0.7: 29.01,32.2 29.07,32.25 30.93,32.25 30.99,32.2 31.2,32.2
  Bottom Layer w1: 41.02,23.9 39.88,25.05 39.88,25.23 ; 41.02,23.9 41.02,24.13 48.9,24.13 10uF#2.2 ; 41.02,23.9 41.02,22.08 4N25.4 ; 29.01,32.2 7.2,32.2 NOREF#3.G 5,25.05 ; 7805.2 39.88,25.23 ; 39.88,25.23 39.75,27.68 38.75,28.68 36.7,28.68 34.8,26.78 34.8,23.74 31.6,20.54 10uF.2 25.91,22.32 25.91,27.79 23.37,30.33 10.29,30.33 5,25.05 ; 5,25.05 NOREF.1 11.43,25 16.64,19.79 16.64,17.38 15.01,15.75 22pF#2.2 22pF.2 ; 31.2,32.2 46.52,32.2 50.86,27.86 50.86,22.91 51.44,22.33 51.44,16.74 4N25.2 56.05,12.68 Z5U_2.1 ; 22pF.2 16.53,8.23 18.68,8.23 20.33,6.58 ATTINY85.4 ; 22pF.2 14.24,9 2N2222A.3 8.64,6.2 10KΩ.2
VCC: length 14.2
  Bottom Layer w1: NOREF#5.B 30,25.03 ; 29.99,25.01 29.97,25 ; NOREF#7.1 31.34,25 1N4935G.2
COIL-: length 10.6
  Bottom Layer w1: ZD_1.2 57.06,21.7 55,23.76 NOREF#2.1 ; NOREF#2.1 55.4,24 ; NOREF#2.1 NOREF#8.P
M+: length 20.7
  Bottom Layer w1: 3362P1.3 3.17,16.49 ; 3.17,16.49 3.3,16.36 LR1.1 ; 3.17,16.49 1.14,14.46 1.14,3.28 3.05,1.38
M-: length 76.5
  Bottom Layer w1: 11.28,13.93 4.89,7.54 4.89,2.2 6.29,0.8 57.66,0.8 58.67,1.82 58.67,4.17 ; 11.28,13.93 Z5U_1.1 ; 11.28,13.93 11.43,14.08
$1N8148: length 13.4
  Bottom Layer w1: Z5U_3.1 46.57,5.69 46.69,5.57 50.93,5.57 4N25.1
$1N8161: length 14.1
  Top Layer w0.5: Z5U_2.2 57.19,14.33 57.19,11.1 57.04,10.95 57.04,5.72 57.19,5.57
  Bottom Layer w1: 1N4007.1 58.45,15.59 Z5U_2.2
$1N8165: length 2.7
  Bottom Layer w1: 1N4007.2 49.88,19.15 ZD_1.1
$1N10205: length 17.7
  Bottom Layer w0.75: ATTINY85.6 28.84,8.64 30.37,7.12 30.37,6.05 28.76,4.44 18.73,4.44 1KΩ#2.2
$1N10206: length 11.4
  Bottom Layer w1: 1KΩ#2.1 6.07,4.28 6.07,7.06 10.54,11.54 2N2222A.2
$1N10209: length 22
  Top Layer w0.5: 31.5,12.93 27.95,12.93 27.44,12.43 27.44,7.99 ATTINY85.5
  Bottom Layer w0.75: 10KΩ.1 19.26,6.2 20.17,5.3 27.55,5.3 ATTINY85.5
$1N10210: length 11.6
  Bottom Layer w0.5: ATTINY85.2 20.17,11.66 22pF#2.1 20.7,17.53 20.7,20.05
$1N10211: length 4.7
  Bottom Layer w1: 3362P1.2 10.37,19.03 50Ω.2
$1N10213: length 14.9
  Top Layer w0.5: 31.88,10.65 33.3,10.65 33.66,11 33.66,12.81 32.02,14.44 CYL.2
  Bottom Layer w0.75: v1(31.75,10.52) 31.54,10.31 1KΩ.2
$1N10215: length 20.6
  Bottom Layer w0.5: 20.43,9.63 17.89,9.63 17.51,9.25 ; 22pF.1 17.51,12.45 16.26,13.7 16.26,14.97 17.91,16.62 17.91,22.11 HC-49.1
$1N10216: length 24.6
  Top Layer w0.5: ATTINY85.7 31.27,9.24 31.27,6.18 32.51,4.93 33.78,4.93 37.41,1.31 45.48,1.31 46.82,2.65
$1N10218: length 8.6
  Bottom Layer w1: Z5U_1.2 3.3,8.25 LR1.2
$1N10220: length 22.7
  Top Layer w0.5: 57.32,2.65 55.8,4.17 37.64,4.17 74AHC1.4
$1N10221: length 100.9
  Top Layer w0.5: 37.21,7.09 36.62,7.09 74AHC1.5 ; 1KΩ.1 26.29,2.39 26.54,2.65 26.54,13.19 27.56,14.2 ATTINY85.8
  Bottom Layer w0.5: 32.73,19.42 32.73,3.91 10kΩ.2 34.75,1.89 39.5,1.89 40.64,3.03 40.64,6.46 40,7.09 v1(37.08,7.09) 36.96,7.22 0805_.1uF2.2 ; ATTINY85.8 27.57,14.2 0805_.1uF1.2
  Bottom Layer w1: 10uF.1 28.84,17.38 28.84,14.71 ; 10uF.1 24.13,22.09 24.13,27.28 22.48,28.94 19.05,28.94 18.13,28.02 11.81,28.02 ; 10uF.1 31.85,18.54 37.34,24.03 7805.3
$1N10223: length 10.6
  Bottom Layer w1: 10uF#2.1 49.51,27.03 43.56,27.03 43.56,27.66 45.62,29.72 1N4935G.1
$1N10386: length 5
  Top Layer w0.5: 74AHC1.2 33.7,6.56 34.7,6.56 34.98,6.28 v1(34.98,4.74)
  Bottom Layer w0.5: 36.32,3.94 35.78,3.94 v1(34.98,4.74)
$1N10391: length 19.4
  Top Layer w0.5: 10kΩ.1 v1(39.24,2.65)
  Bottom Layer w0.5: 4N25.5 44.49,9.29 44.49,7.93 42.78,6.21 42.78,5.18 44.49,3.46 10kΩ.1 ; v1(39.24,2.65) 38.35,3.54

## Copper pours and planes (outline as drawn; the poured copper is in the pictures)
(no net) on Top Layer: 52,27 58,27 58,23 52,23

Small or netless copper shapes (teardrops, artwork), in the pictures only: 1 on Top Layer

## Text on the board
Bottom Silkscreen Layer: M- | G | M+ | B | P
Top Silkscreen Layer: 22R / Tach Board | G | M+ | B | Type B / V2 | P | M-
